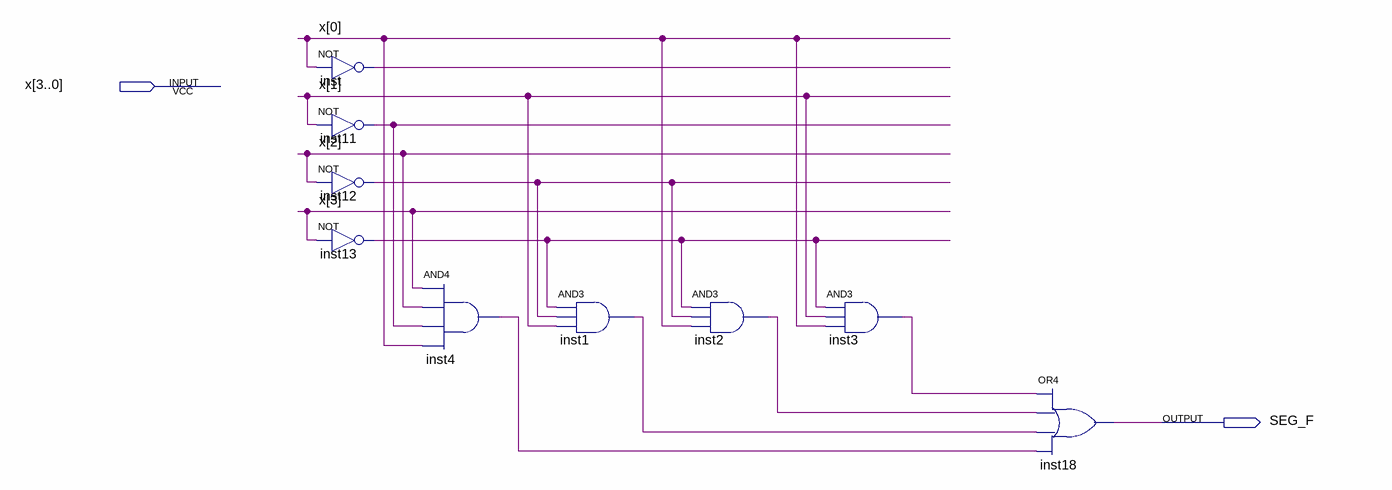
[diagram p0: schematic sheet]
// Quartus schematic SEG_F.bdf as structural Verilog: 9 symbols, 2 pins
module SEG_F (
  input  [3:0] x,
  output SEG_F
);

  wire inst1_out, inst2_out, inst3_out, inst4_out, inst11_out, inst12_out, inst13_out, inst_out;

  not inst (inst_out, x[0]);
  not inst11 (inst11_out, x[1]);
  not inst12 (inst12_out, x[2]);
  not inst13 (inst13_out, x[3]);
  and inst4 (inst4_out, x[3], x[2], inst11_out, x[0]);
  and inst1 (inst1_out, inst13_out, inst12_out, x[1]);
  and inst2 (inst2_out, inst13_out, inst12_out, x[0]);
  and inst3 (inst3_out, inst13_out, x[1], x[0]);
  or inst18 (SEG_F, inst3_out, inst2_out, inst1_out, inst4_out);
endmodule
